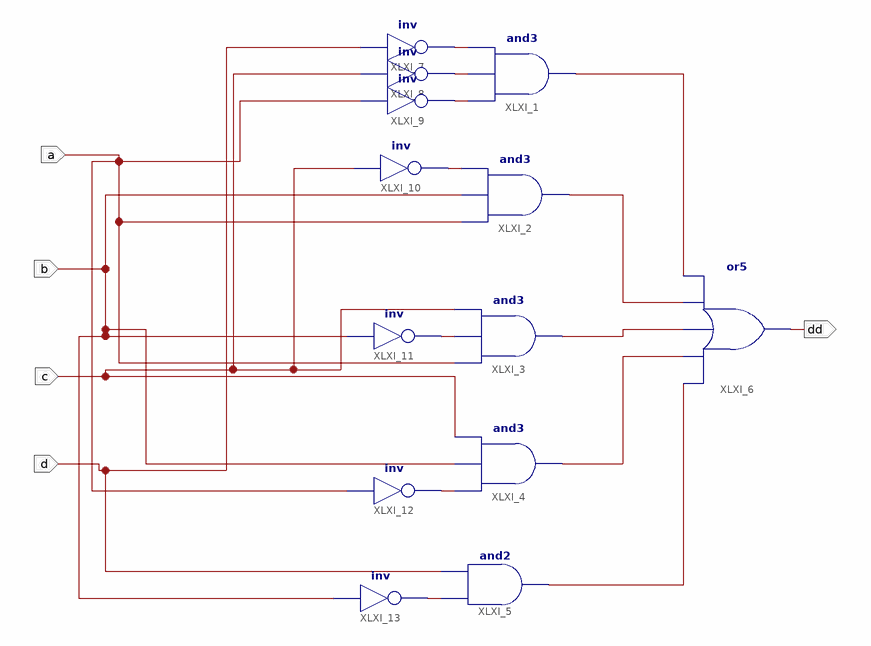
[diagram p0: schematic sheet 1]
// Xilinx ISE schematic hexd.sch (spartan6) as structural Verilog: 13 symbols, 5 ports
module hexd (
  input  c,
  input  d,
  input  a,
  input  b,
  output dd
);

  wire XLXN_1, XLXN_2, XLXN_3, XLXN_4, XLXN_5, XLXN_6, XLXN_7, XLXN_8, XLXN_9, XLXN_10, XLXN_11, XLXN_12;

  and XLXI_1 (XLXN_1, XLXN_8, XLXN_7, XLXN_6);
  and XLXI_2 (XLXN_2, a, b, XLXN_9);
  and XLXI_3 (XLXN_3, a, XLXN_10, c);
  and XLXI_4 (XLXN_4, XLXN_11, b, c);
  and XLXI_5 (XLXN_5, XLXN_12, d);
  or XLXI_6 (dd, XLXN_5, XLXN_4, XLXN_3, XLXN_2, XLXN_1);
  not XLXI_7 (XLXN_6, d);
  not XLXI_8 (XLXN_7, c);
  not XLXI_9 (XLXN_8, a);
  not XLXI_10 (XLXN_9, c);
  not XLXI_11 (XLXN_10, b);
  not XLXI_12 (XLXN_11, a);
  not XLXI_13 (XLXN_12, b);
endmodule
